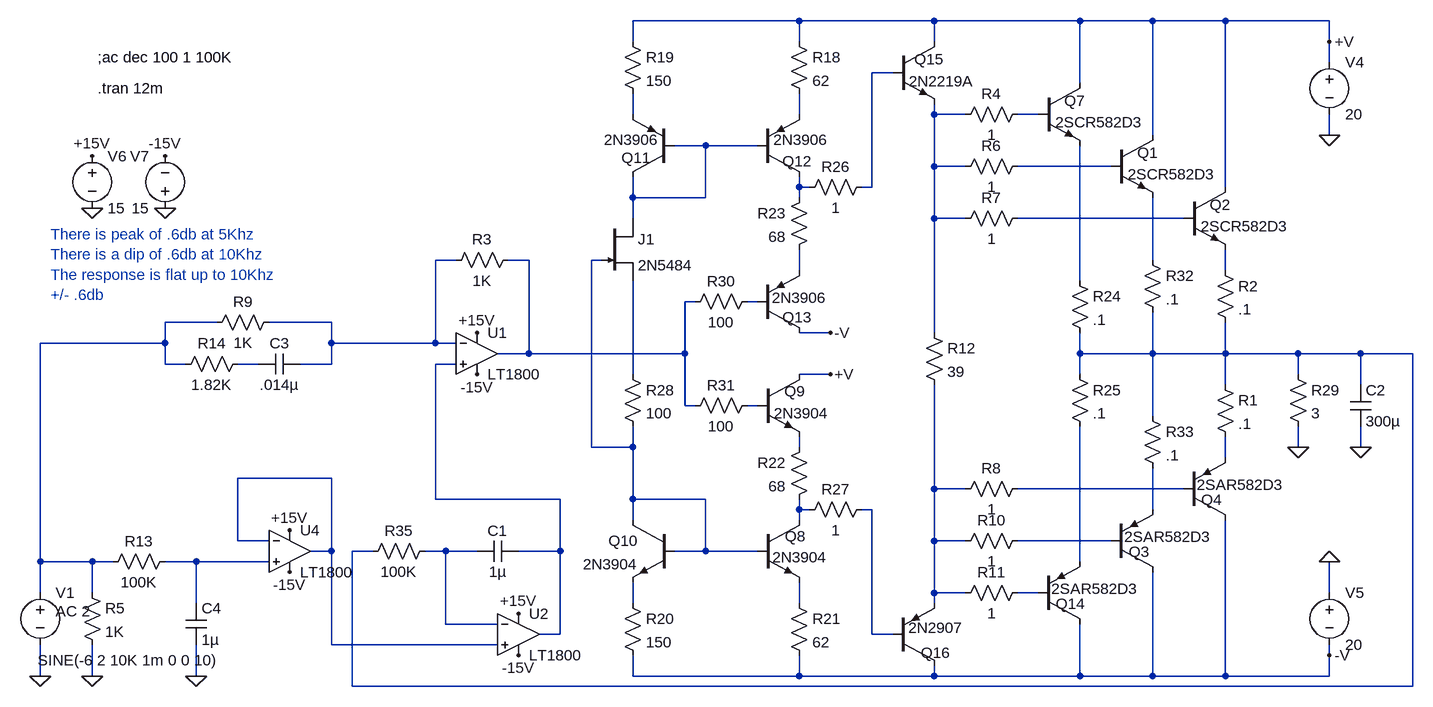
[diagram p0: schematic NOT_USED_Current Amp-Adj_Bias-Servo-2.asc]
NOT_USED_Current Amp-Adj_Bias-Servo-2.asc, the LTspice schematic file:
Version 4
SHEET 1 880 712
WIRE -160 -384 -416 -384
WIRE 48 -384 -160 -384
WIRE 272 -384 48 -384
WIRE 384 -384 272 -384
WIRE 496 -384 384 -384
WIRE 656 -384 496 -384
WIRE -416 -352 -416 -384
WIRE -160 -352 -160 -384
WIRE 48 -352 48 -384
WIRE 656 -352 656 -384
WIRE 656 -320 656 -352
WIRE -16 -304 -48 -304
WIRE 272 -288 272 -384
WIRE -416 -240 -416 -272
WIRE -160 -240 -160 -272
WIRE 48 -240 48 -256
WIRE 96 -240 48 -240
WIRE 208 -240 176 -240
WIRE 384 -208 384 -384
WIRE 656 -208 656 -240
WIRE -304 -192 -352 -192
WIRE -224 -192 -304 -192
WIRE 48 -160 48 -240
WIRE 96 -160 48 -160
WIRE 320 -160 176 -160
WIRE -160 -128 -160 -144
WIRE -144 -128 -160 -128
WIRE -48 -128 -48 -304
WIRE -48 -128 -64 -128
WIRE 496 -128 496 -384
WIRE -416 -112 -416 -144
WIRE -304 -112 -304 -192
WIRE -304 -112 -416 -112
WIRE -160 -112 -160 -128
WIRE -416 -80 -416 -112
WIRE 48 -80 48 -160
WIRE 96 -80 48 -80
WIRE 432 -80 176 -80
WIRE -688 -16 -720 -16
WIRE -576 -16 -608 -16
WIRE -464 -16 -480 -16
WIRE 384 -16 384 -112
WIRE -160 0 -160 -32
WIRE 496 0 496 -32
WIRE 272 16 272 -192
WIRE -320 48 -336 48
WIRE -224 48 -240 48
WIRE -1056 80 -1136 80
WIRE -880 80 -976 80
WIRE -112 96 -160 96
WIRE 48 96 48 -80
WIRE -1136 112 -1136 80
WIRE -1136 112 -1328 112
WIRE -880 112 -880 80
WIRE -720 112 -720 -16
WIRE -720 112 -880 112
WIRE -688 112 -720 112
WIRE -576 128 -576 -16
WIRE -576 128 -624 128
WIRE -336 128 -336 48
WIRE -336 128 -576 128
WIRE 272 128 272 96
WIRE 384 128 384 64
WIRE 384 128 272 128
WIRE 496 128 496 80
WIRE 496 128 384 128
WIRE 608 128 496 128
WIRE 704 128 608 128
WIRE 784 128 704 128
WIRE -1136 144 -1136 112
WIRE -1104 144 -1136 144
WIRE -992 144 -1024 144
WIRE -880 144 -880 112
WIRE -880 144 -928 144
WIRE -688 144 -720 144
WIRE -416 160 -416 16
WIRE -112 160 -160 160
WIRE 272 160 272 128
WIRE 608 160 608 128
WIRE 496 176 496 128
WIRE 704 176 704 128
WIRE -336 208 -336 128
WIRE -320 208 -336 208
WIRE -224 208 -240 208
WIRE 384 224 384 128
WIRE -480 272 -480 -16
WIRE -416 272 -416 240
WIRE -416 272 -480 272
WIRE -160 272 -160 256
WIRE 608 272 608 240
WIRE 704 272 704 240
WIRE 496 288 496 256
WIRE -880 320 -1024 320
WIRE 48 336 48 176
WIRE 96 336 48 336
WIRE 432 336 176 336
WIRE -720 352 -720 144
WIRE -528 352 -720 352
WIRE -416 352 -416 272
WIRE -304 352 -416 352
WIRE -160 368 -160 352
WIRE -144 368 -160 368
WIRE -48 368 -64 368
WIRE 384 368 384 304
WIRE -416 384 -416 352
WIRE -160 384 -160 368
WIRE -1024 416 -1024 320
WIRE -976 416 -1024 416
WIRE 48 416 48 336
WIRE 96 416 48 416
WIRE 320 416 176 416
WIRE -880 432 -880 320
WIRE -880 432 -912 432
WIRE -816 432 -848 432
WIRE -704 432 -736 432
WIRE -656 432 -704 432
WIRE -528 432 -528 352
WIRE -528 432 -592 432
WIRE -304 432 -304 352
WIRE -304 432 -352 432
WIRE -224 432 -304 432
WIRE -1328 448 -1328 112
WIRE -1248 448 -1328 448
WIRE -1216 448 -1248 448
WIRE -1088 448 -1136 448
WIRE -976 448 -1088 448
WIRE 272 448 272 240
WIRE -1328 496 -1328 448
WIRE -1248 496 -1248 448
WIRE 48 496 48 416
WIRE 96 496 48 496
WIRE 208 496 176 496
WIRE 656 496 656 448
WIRE -1088 512 -1088 448
WIRE -416 512 -416 480
WIRE -160 512 -160 480
WIRE 48 512 48 496
WIRE -704 544 -704 432
WIRE -624 544 -704 544
WIRE -528 560 -528 432
WIRE -528 560 -560 560
WIRE -48 560 -48 368
WIRE -16 560 -48 560
WIRE -880 576 -880 432
WIRE -624 576 -880 576
WIRE 656 592 656 576
WIRE -1328 624 -1328 576
WIRE -1248 624 -1248 576
WIRE -1088 624 -1088 576
WIRE -416 624 -416 592
WIRE -160 624 -160 592
WIRE -160 624 -416 624
WIRE 48 624 48 608
WIRE 48 624 -160 624
WIRE 272 624 272 544
WIRE 272 624 48 624
WIRE 384 624 384 464
WIRE 384 624 272 624
WIRE 496 624 496 384
WIRE 496 624 384 624
WIRE 656 624 656 592
WIRE 656 624 496 624
WIRE -848 640 -848 432
WIRE 784 640 784 128
WIRE 784 640 -848 640
FLAG 656 -208 0
FLAG 656 448 0
FLAG 608 272 0
FLAG 656 -352 +V
FLAG -112 160 +V
FLAG -112 96 -V
FLAG 656 592 -V
FLAG -1136 -96 0
FLAG -1248 -96 0
FLAG -592 528 +15V
FLAG -1248 -176 +15V
FLAG -592 592 -15V
FLAG -1136 -176 -15V
FLAG -1248 624 0
FLAG -1328 624 0
FLAG 704 272 0
FLAG -1088 624 0
FLAG -944 400 +15V
FLAG -944 464 -15V
FLAG -656 96 +15V
FLAG -656 160 -15V
DATAFLAG -304 -192 ""
DATAFLAG -304 432 ""
DATAFLAG -752 576 ""
DATAFLAG -624 352 ""
DATAFLAG -368 128 ""
DATAFLAG 672 128 ""
DATAFLAG 48 0 ""
DATAFLAG 48 240 ""
DATAFLAG -48 -208 ""
DATAFLAG -48 464 ""
DATAFLAG -1056 448 ""
SYMBOL voltage 656 -336 R0
WINDOW 123 0 0 Left 2
WINDOW 39 0 0 Left 2
SYMATTR InstName V4
SYMATTR Value 20
SYMBOL voltage 656 480 R0
WINDOW 123 0 0 Left 2
WINDOW 39 0 0 Left 2
SYMATTR InstName V5
SYMATTR Value 20
SYMBOL npn 208 -288 R0
WINDOW 0 40 27 Left 2
WINDOW 3 26 60 Left 2
SYMATTR InstName Q7
SYMATTR Value 2SCR582D3
SYMBOL npn -224 384 R0
WINDOW 0 42 25 Left 2
WINDOW 3 23 57 Left 2
SYMATTR InstName Q8
SYMATTR Value 2N3904
SYMBOL npn -224 160 R0
WINDOW 0 41 26 Left 2
WINDOW 3 25 60 Left 2
SYMATTR InstName Q9
SYMATTR Value 2N3904
SYMBOL npn -352 384 M0
SYMATTR InstName Q10
SYMATTR Value 2N3904
SYMBOL pnp -352 -144 R180
WINDOW 0 36 29 Left 2
WINDOW 3 24 57 Left 2
SYMATTR InstName Q11
SYMATTR Value 2N3906
SYMBOL pnp -224 -144 M180
WINDOW 0 38 24 Left 2
WINDOW 3 24 57 Left 2
SYMATTR InstName Q12
SYMATTR Value 2N3906
SYMBOL pnp -224 96 M180
WINDOW 0 38 24 Left 2
WINDOW 3 22 54 Left 2
SYMATTR InstName Q13
SYMATTR Value 2N3906
SYMBOL pnp 208 544 M180
WINDOW 0 27 31 Left 2
WINDOW 3 20 54 Left 2
SYMATTR InstName Q14
SYMATTR Value 2SAR582D3
SYMBOL res -176 -368 R0
SYMATTR InstName R18
SYMATTR Value 62
SYMBOL res -432 -368 R0
SYMATTR InstName R19
SYMATTR Value 150
SYMBOL res -432 496 R0
SYMATTR InstName R20
SYMATTR Value 150
SYMBOL res -176 496 R0
SYMATTR InstName R21
SYMATTR Value 62
SYMBOL res -144 256 M0
SYMATTR InstName R22
SYMATTR Value 68
SYMBOL res -144 -128 M0
SYMATTR InstName R23
SYMATTR Value 68
SYMBOL res 256 0 R0
SYMATTR InstName R24
SYMATTR Value .1
SYMBOL res 256 144 R0
SYMATTR InstName R25
SYMATTR Value .1
SYMBOL res -48 -144 R90
WINDOW 0 0 56 VBottom 2
WINDOW 3 32 56 VTop 2
SYMATTR InstName R26
SYMATTR Value 1
SYMBOL res -48 352 R90
WINDOW 0 0 56 VBottom 2
WINDOW 3 32 56 VTop 2
SYMATTR InstName R27
SYMATTR Value 1
SYMBOL res -432 144 R0
SYMATTR InstName R28
SYMATTR Value 100
SYMBOL njf -464 -80 R0
SYMATTR InstName J1
SYMATTR Value 2N5484
SYMBOL res 592 144 R0
SYMATTR InstName R29
SYMATTR Value 3
SYMBOL res -336 64 R270
WINDOW 0 32 56 VTop 2
WINDOW 3 0 56 VBottom 2
SYMATTR InstName R30
SYMATTR Value 100
SYMBOL res -336 224 R270
WINDOW 0 32 56 VTop 2
WINDOW 3 0 56 VBottom 2
SYMATTR InstName R31
SYMATTR Value 100
SYMBOL npn -16 -352 R0
WINDOW 0 33 27 Left 2
WINDOW 3 25 61 Left 2
SYMATTR InstName Q15
SYMATTR Value 2N2219A
SYMBOL pnp -16 608 M180
WINDOW 0 43 20 Left 2
WINDOW 3 24 58 Left 2
SYMATTR InstName Q16
SYMATTR Value 2N2907
SYMBOL res 368 -32 R0
SYMATTR InstName R32
SYMATTR Value .1
SYMBOL res 368 208 R0
SYMATTR InstName R33
SYMATTR Value .1
SYMBOL cap -592 416 R90
WINDOW 0 0 32 VBottom 2
WINDOW 3 32 32 VTop 2
SYMATTR InstName C1
SYMATTR Value 1µ
SYMBOL voltage -1248 -192 R0
WINDOW 123 0 0 Left 2
WINDOW 39 0 0 Left 2
SYMATTR InstName V6
SYMATTR Value 15
SYMBOL voltage -1136 -80 R180
WINDOW 0 24 96 Left 2
WINDOW 3 24 16 Left 2
WINDOW 123 0 0 Left 2
WINDOW 39 0 0 Left 2
SYMATTR InstName V7
SYMATTR Value 15
SYMBOL res -720 416 R90
WINDOW 0 0 56 VBottom 2
WINDOW 3 32 56 VTop 2
SYMATTR InstName R35
SYMATTR Value 100K
SYMBOL res -1264 480 R0
SYMATTR InstName R5
SYMATTR Value 1K
SYMBOL npn 320 -208 R0
WINDOW 0 40 27 Left 2
WINDOW 3 26 60 Left 2
SYMATTR InstName Q1
SYMATTR Value 2SCR582D3
SYMBOL npn 432 -128 R0
WINDOW 0 40 27 Left 2
WINDOW 3 26 60 Left 2
SYMATTR InstName Q2
SYMATTR Value 2SCR582D3
SYMBOL pnp 320 464 M180
WINDOW 0 27 31 Left 2
WINDOW 3 20 54 Left 2
SYMATTR InstName Q3
SYMATTR Value 2SAR582D3
SYMBOL pnp 432 384 M180
WINDOW 0 27 31 Left 2
WINDOW 3 20 54 Left 2
SYMATTR InstName Q4
SYMATTR Value 2SAR582D3
SYMBOL res 480 160 R0
SYMATTR InstName R1
SYMATTR Value .1
SYMBOL res 480 -16 R0
SYMATTR InstName R2
SYMATTR Value .1
SYMBOL res 192 -256 R90
WINDOW 0 0 56 VBottom 2
WINDOW 3 32 56 VTop 2
SYMATTR InstName R4
SYMATTR Value 1
SYMBOL res 192 -176 R90
WINDOW 0 0 56 VBottom 2
WINDOW 3 32 56 VTop 2
SYMATTR InstName R6
SYMATTR Value 1
SYMBOL res 192 -96 R90
WINDOW 0 0 56 VBottom 2
WINDOW 3 32 56 VTop 2
SYMATTR InstName R7
SYMATTR Value 1
SYMBOL res 192 320 R90
WINDOW 0 0 56 VBottom 2
WINDOW 3 32 56 VTop 2
SYMATTR InstName R8
SYMATTR Value 1
SYMBOL res 192 400 R90
WINDOW 0 0 56 VBottom 2
WINDOW 3 32 56 VTop 2
SYMATTR InstName R10
SYMATTR Value 1
SYMBOL res 192 480 R90
WINDOW 0 0 56 VBottom 2
WINDOW 3 32 56 VTop 2
SYMATTR InstName R11
SYMATTR Value 1
SYMBOL res 32 80 R0
SYMATTR InstName R12
SYMATTR Value 39
SYMBOL voltage -1328 480 R0
WINDOW 3 -4 120 Left 2
WINDOW 123 24 44 Left 2
WINDOW 39 0 0 Left 0
SYMATTR Value SINE(-6 2 10K 1m 0 0 10)
SYMATTR Value2 AC 2
SYMATTR InstName V1
SYMBOL res -960 64 R90
WINDOW 0 0 56 VBottom 2
WINDOW 3 32 56 VTop 2
SYMATTR InstName R9
SYMATTR Value 1K
SYMBOL cap 688 176 R0
SYMATTR InstName C2
SYMATTR Value 300µ
SYMBOL res -1120 432 R90
WINDOW 0 0 56 VBottom 2
WINDOW 3 32 56 VTop 2
SYMATTR InstName R13
SYMATTR Value 100K
SYMBOL cap -1104 512 R0
SYMATTR InstName C4
SYMATTR Value 1µ
SYMBOL res -592 -32 R90
WINDOW 0 0 56 VBottom 2
WINDOW 3 32 56 VTop 2
SYMATTR InstName R3
SYMATTR Value 1K
SYMBOL OpAmps\\LT1800 -944 368 R0
SYMATTR InstName U4
SYMBOL OpAmps\\LT1800 -656 64 R0
SYMATTR InstName U1
SYMBOL OpAmps\\LT1800 -592 496 R0
SYMATTR InstName U2
SYMBOL res -1008 128 R90
WINDOW 0 0 56 VBottom 2
WINDOW 3 32 56 VTop 2
SYMATTR InstName R14
SYMATTR Value 1.82K
SYMBOL cap -928 128 R90
WINDOW 0 0 32 VBottom 2
WINDOW 3 32 32 VTop 2
SYMATTR InstName C3
SYMATTR Value .014µ
TEXT -1240 -280 Left 2 !.tran 12m
TEXT -1240 -328 Left 2 !;ac dec 100 1 100K
TEXT -1312 -56 Left 2 ;There is peak of .6db at 5Khz\nThere is a dip of .6db at 10Khz\nThe response is flat up to 10Khz\n+/- .6db

The netlist it stands for:
* NOT_USED_Current Amp-Adj_Bias-Servo-2.asc
V4 +V 0 20
V5 0 -V 20
Q7 +V N005 N016 0 2SCR582D3
Q8 N029 N012 N038 0 2N3904
Q9 +V N023 N024 0 2N3904
Q10 N012 N012 N037 0 2N3904
Q11 N006 N006 N002 0 2N3906
Q12 N008 N006 N003 0 2N3906
Q13 -V N017 N014 0 2N3906
Q14 -V N036 N035 0 2SAR582D3
R18 +V N003 62
R19 +V N002 150
R20 N037 -V 150
R21 N038 -V 62
R22 N024 N029 68
R23 N008 N014 68
R24 N016 N019 .1
R25 N019 N035 .1
R26 N001 N008 1
R27 N030 N029 1
R28 N022 N012 100
J1 N006 N012 N022 2N5484
R29 N019 0 3
R30 N011 N017 100
R31 N011 N023 100
Q15 +V N001 N004 0 2N2219A
Q16 -V N030 N027 0 2N2907
R32 N013 N019 .1
R33 N019 N031 .1
C1 N021 N033 1µ
V6 +15V 0 15
V7 0 -15V 15
R35 N033 N019 100K
R5 N018 0 1K
Q1 +V N007 N013 0 2SCR582D3
Q2 +V N009 N015 0 2SCR582D3
Q3 -V N032 N031 0 2SAR582D3
Q4 -V N028 N025 0 2SAR582D3
R1 N019 N025 .1
R2 N015 N019 .1
R4 N005 N004 1
R6 N007 N004 1
R7 N009 N004 1
R8 N028 N027 1
R10 N032 N027 1
R11 N036 N027 1
R12 N004 N027 39
V1 N018 0 SINE(-6 2 10K 1m 0 0 10) AC 2
R9 N010 N018 1K
C2 N019 0 300µ
R13 N034 N018 100K
C4 N034 0 1µ
R3 N011 N010 1K
XU4 N034 N026 +15V -15V N026 LT1800  ; pins In+ In- V+ V- OUT
XU1 N021 N010 +15V -15V N011 LT1800  ; pins In+ In- V+ V- OUT
XU2 N026 N033 +15V -15V N021 LT1800  ; pins In+ In- V+ V- OUT
R14 N020 N018 1.82K
C3 N010 N020 .014µ
.model NPN NPN
.model PNP PNP
.lib standard.bjt
.model NJF NJF
.model PJF PJF
.lib standard.jft
.tran 12m
;ac dec 100 1 100K
* There is peak of .6db at 5Khz
* There is a dip of .6db at 10Khz
* The response is flat up to 10Khz
* +/- .6db
.backanno
.end